# EAGLE design colorimeter (EAGLE 9.3.1)
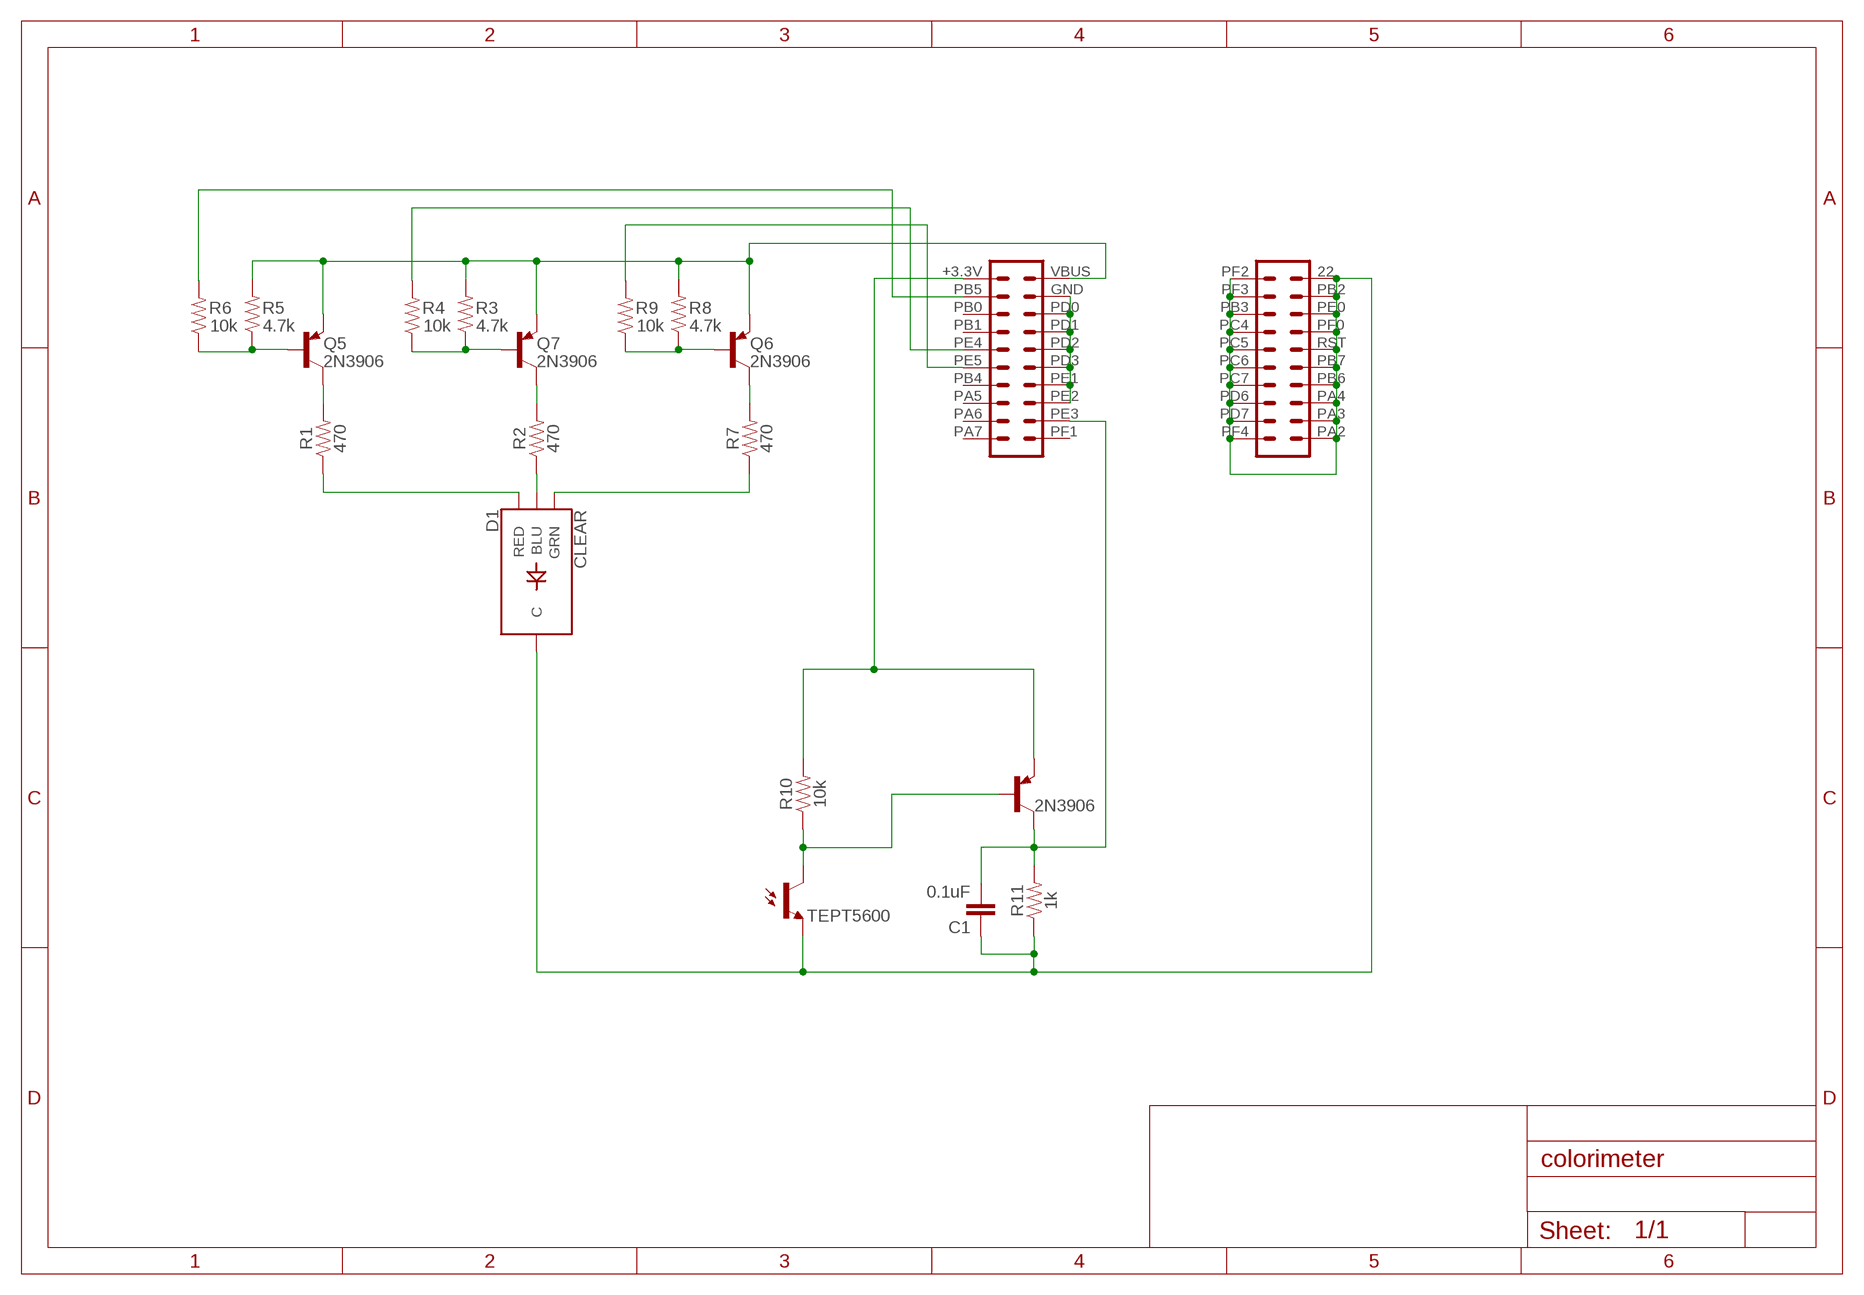
[diagram p0: schematic, sheet 1]

## Parts
C1  0.1uF  0.1UF-KIT-EZ-50V-20%  [CAP-PTH-SMALL-KIT]
D1  CLEAR  LED-RGB-CCCLEAR  [LED-RGB-THRU]
Q1  TEPT5600  PHOTOTRANSISTORPT17-21C-L41-TR8  [PT17-21C-L41-TR8]
Q5  2N3906  2N2907  [TO92-EBC-OVAL]
Q6  2N3906  2N2907  [TO92-EBC-OVAL]
Q7  2N3906  2N2907  [TO92-EBC-OVAL]
R1  470  1KOHM-HORIZ-1/4W-5%  [AXIAL-0.3]
R2  470  1KOHM-HORIZ-1/4W-5%  [AXIAL-0.3]
R3  4.7k  1KOHM-HORIZ-1/4W-5%  [AXIAL-0.3]
R4  10k  1KOHM-HORIZ-1/4W-5%  [AXIAL-0.3]
R5  4.7k  1KOHM-HORIZ-1/4W-5%  [AXIAL-0.3]
R6  10k  1KOHM-HORIZ-1/4W-5%  [AXIAL-0.3]
R7  470  1KOHM-HORIZ-1/4W-5%  [AXIAL-0.3]
R8  4.7k  1KOHM-HORIZ-1/4W-5%  [AXIAL-0.3]
R9  10k  1KOHM-HORIZ-1/4W-5%  [AXIAL-0.3]
R10  10k  10KOHM-HORIZ-1/4W-1%  [AXIAL-0.3]
R11  1k  10KOHM-HORIZ-1/4W-1%  [AXIAL-0.3]
T2  2N3906  2N3906-PNP-TO92-EBC  [TO92-EBC]
U$1  LAUNCHPAD_PINS  [LAUNCHPAD_PINS]

## Nets
N$1: Q5.B R5.P$1 R6.P$1
N$2: Q5.C R1.P$2
N$3: R9.P$2 U$1.PE5
N$4: R4.P$2 U$1.PE4
N$5: Q7.B R3.P$1 R4.P$1
N$6: Q7.C R2.P$2
N$7: D1.1(RED) R1.P$1
N$8: R6.P$2 U$1.PB5
N$9: Q6.B R8.P$1 R9.P$1
N$10: Q6.C R7.P$2
N$11: D1.4(BLU) R2.P$1
N$12: Q1.C R10.P$1 T2.B
N$13: D1.3(GRN) R7.P$1
N$14: C1.2 R11.P$2 T2.C U$1.PE3
N$15: R10.P$2 T2.E U$1.+3.3V
N$16: Q5.E Q6.E Q7.E R3.P$2 R5.P$2 R8.P$2 U$1.VBUS
N$18: C1.1 D1.2(C) Q1.E R11.P$1 U$1.22 U$1.PA2 U$1.PA3 U$1.PA4 U$1.PB2 U$1.PB3 U$1.PB6 U$1.PB7 U$1.PC4 U$1.PC5 U$1.PC6 U$1.PC7 U$1.PD6 U$1.PD7 U$1.PE0 U$1.PF0 U$1.PF2 U$1.PF3 U$1.PF4 U$1.RST
N$19: U$1.GND U$1.PD0 U$1.PD1 U$1.PD2 U$1.PD3 U$1.PE1 U$1.PE2
Unconnected: U$1.PA5 U$1.PA6 U$1.PA7 U$1.PB0 U$1.PB1 U$1.PB4 U$1.PF1

## Library data of the parts
C1 = SparkFun-Capacitors:0.1UF: 0.1µF ceramic capacitors A capacitor is a passive two-terminal electrical component used to store electrical energy temporarily in an electric field.; PROD_ID: CAP-08370
D1 = SparkFun-LED:LED-RGB-CC: LED-RGB Common Cathode Packages: LED RGB-THRU LED_PIRANHA_5MM SparkFun Products: RGB Diffused Common Cathode- Diffuse <[https://www.sparkfun.com/products/9264]> RGB Diffused Common Cathode - Clear <[https://www.sparkfun.com/products/105]> LED-RGB 5mm Square (Piranha) <[https://www.sparkfun.com/products/11679]>; PROD_ID: DIO-08418
Q1 = SparkFun-DiscreteSemi:PHOTOTRANSISTOR: Phototransistor PT17-21C/L41/TR8 is a phototransistor in miniature SMD package which is molded in a water clear with flat top view lens. The device is Spectrally matched to visible and infrared emitting diode. Datasheet <http://www.everlight.com/file/ProductFile/PT17-21C-L41-TR8.pdf> SparkFun Products: SparkFun Electric Imp imp002 Breakout <https://www.sparkfun.com/products/12958>; PROD_ID: TRANS-12141; VALUE: 20mA/30V
Q5-Q7 = adafruit:2N2907*: PNP Transistor Big Oval pads
R1-R9 = SparkFun-Resistors:1KOHM: 1kΩ resistor A resistor is a passive two-terminal electrical component that implements electrical resistance as a circuit element. Resistors act to reduce current flow, and, at the same time, act to lower voltage levels within circuits. - Wikipedia; PROD_ID: RES-08380; VALUE: 1k
R10 = SparkFun-Resistors:10KOHM: 10kΩ resistor A resistor is a passive two-terminal electrical component that implements electrical resistance as a circuit element. Resistors act to reduce current flow, and, at the same time, act to lower voltage levels within circuits. - Wikipedia; PROD_ID: RES-12183
R11 = SparkFun-Resistors:10KOHM: 10kΩ resistor A resistor is a passive two-terminal electrical component that implements electrical resistance as a circuit element. Resistors act to reduce current flow, and, at the same time, act to lower voltage levels within circuits. - Wikipedia; PROD_ID: RES-12183; VALUE: 10k
T2 = transistor-neu-to92:*-PNP-: PNP Transistror
U$1 = kit:LAUNCHPAD_PINS

## Board
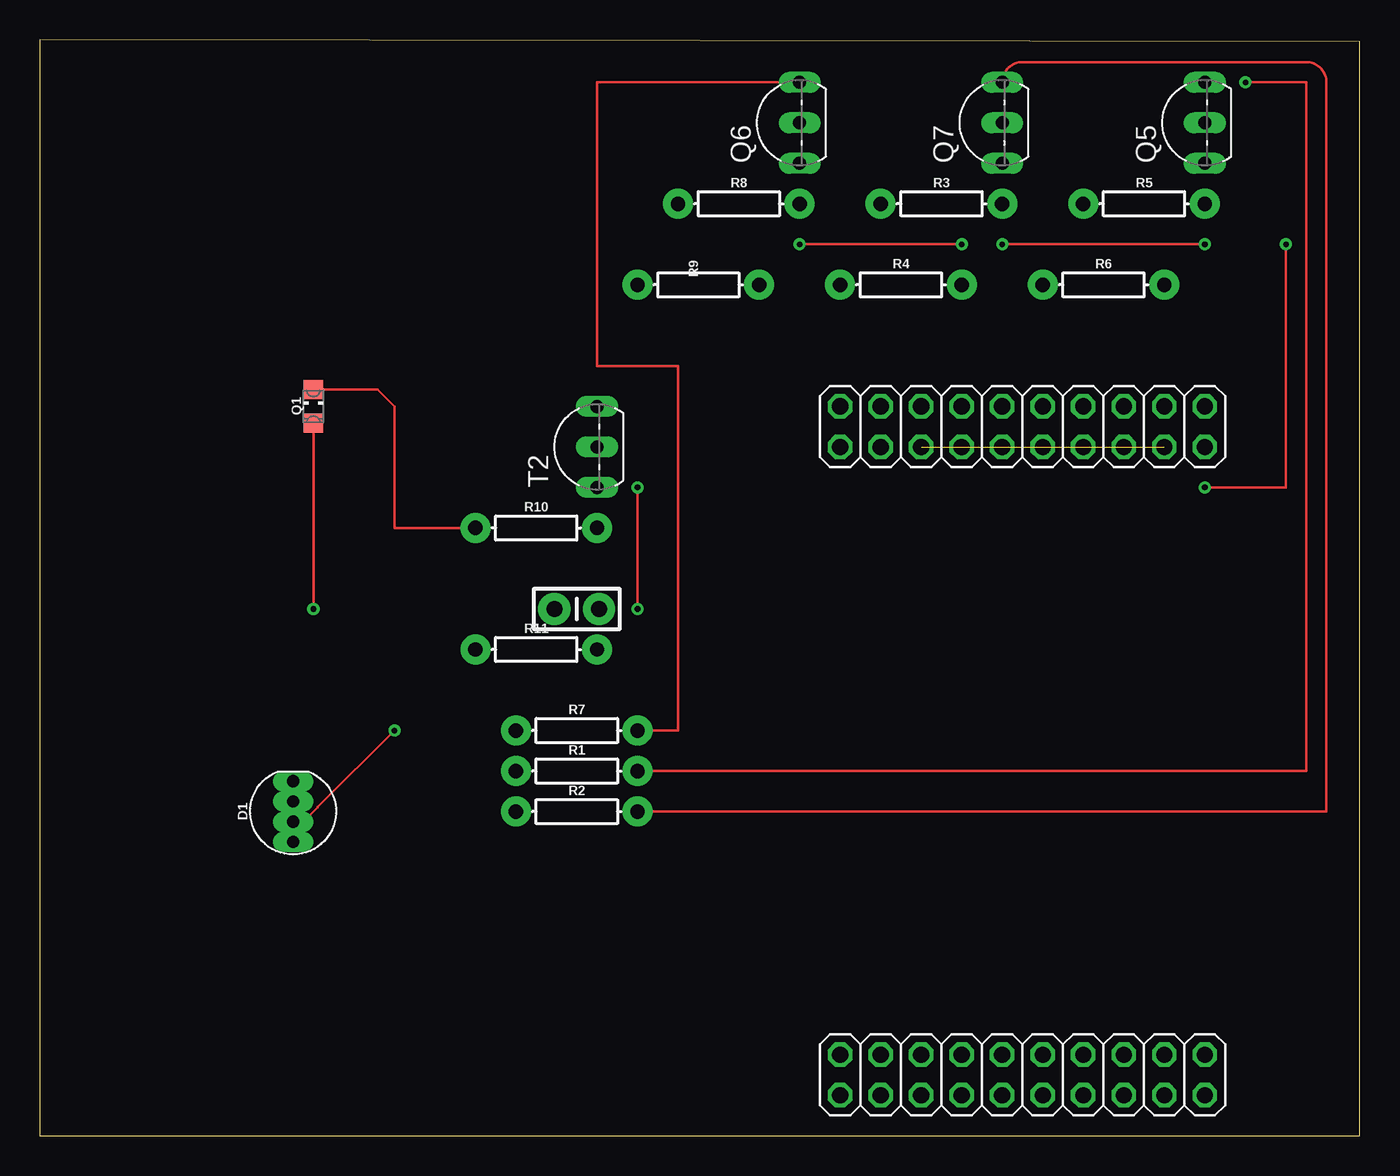
[diagram p1: board, top side]
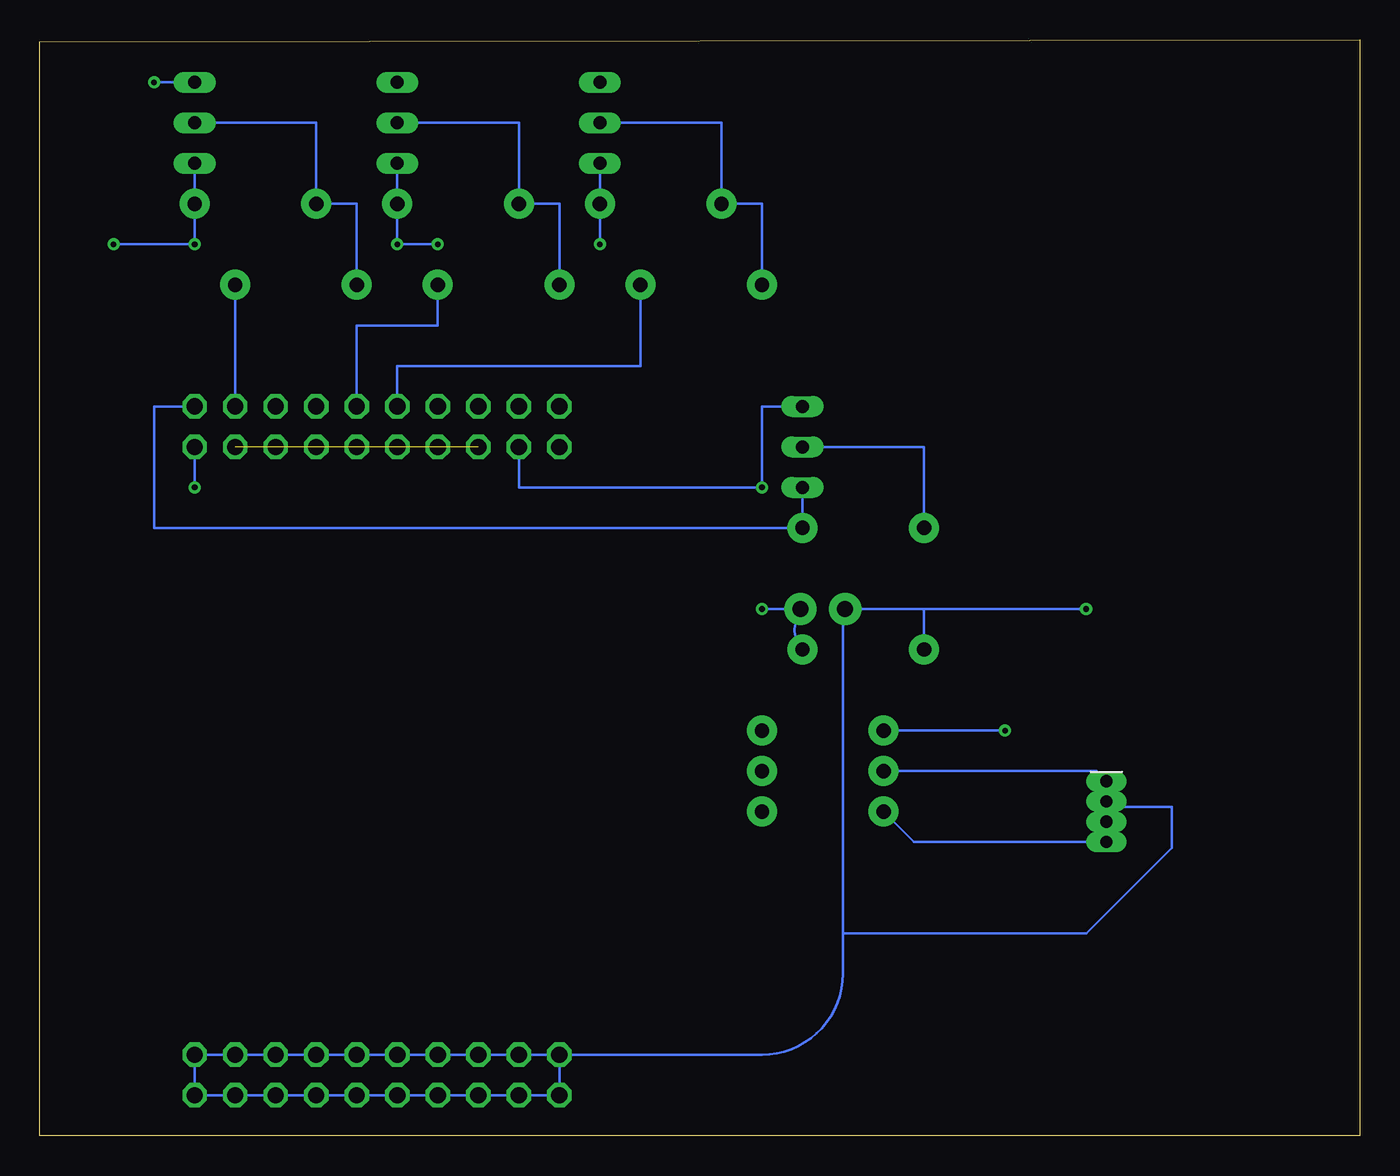
[diagram p2: board, bottom side, seen from below]

Size 82.73 x 68.7 mm. Coordinates in mm from the lower left corner, seen from the top.
Outline: 0,0 82.73,0 82.73,68.57 0,68.7 0,0
Copper layers (1*16): Top 0.035mm / dielectric 1.5mm / Bottom 0.035mm
Design rules "untitled": minimum track width 6mil, minimum drill 0.35mm, track to track 0.205mm, track to pad 0.205mm, pad to pad 0.205mm, via to via 0.205mm, smd to smd 6mil, copper to edge 40mil, drill to drill 6mil, minimum pad ring 10mil, minimum via ring 8mil, stop-mask expansion 4mil, vias tented up to drill 0mil, thermal gap 10mil

### Footprints (pad centres in the part's own frame; a part is rotated, then mirrored left to right if it is on the bottom)
CAP-PTH-SMALL-KIT = drill 1.016 pad 2.032: 1 -1.397,0; 2 1.397,0
LED-RGB-THRU = drill 0.762 pad 0.889 long: 1 1.905,0; 2 0.635,0; 3 -0.635,0; 4 -1.905,0
PT17-21C-L41-TR8 = smd 1.2 x 1.2: C 0,1.05; E 0,-1.05
TO92-EBC-OVAL = drill 0.813 long: B 0,-1.27; C 2.54,-1.27; E -2.54,-1.27
AXIAL-0.3 = drill 0.9 pad 1.88: P$1 -3.81,0; P$2 3.81,0
TO92-EBC = drill 0.813 long: B 0,-1.27; C 2.54,-1.27; E -2.54,-1.27
LAUNCHPAD_PINS = drill 1.016 octagon: 22 31.75,16.51; +3.3V -11.43,16.51; GND -8.89,13.97; PA2 31.75,-6.35; PA3 31.75,-3.81; PA4 31.75,-1.27; PA5 -11.43,-1.27; PA6 -11.43,-3.81; PA7 -11.43,-6.35; PB0 -11.43,11.43; PB1 -11.43,8.89; PB2 31.75,13.97; PB3 29.21,11.43; PB4 -11.43,1.27; PB5 -11.43,13.97; PB6 31.75,1.27; PB7 31.75,3.81; PC4 29.21,8.89; PC5 29.21,6.35; PC6 29.21,3.81; PC7 29.21,1.27; PD0 -8.89,11.43; PD1 -8.89,8.89; PD2 -8.89,6.35; PD3 -8.89,3.81; PD6 29.21,-1.27; PD7 29.21,-3.81; PE0 31.75,11.43; PE1 -8.89,1.27; PE2 -8.89,-1.27; PE3 -8.89,-3.81; PE4 -11.43,6.35; PE5 -11.43,3.81; PF0 31.75,8.89; PF1 -8.89,-6.35; PF2 29.21,16.51; PF3 29.21,13.97; PF4 29.21,-6.35; RST 31.75,6.35; VBUS -8.89,16.51

### Placement (x,y rotation side)
C1  33.66,33.02 0 top
D1  15.88,20.32 90 top
Q1  17.14,45.72 0 top
Q5  71.75,63.5 90 top
Q6  46.36,63.5 90 top
Q7  59.05,63.5 90 top
R1  33.66,22.86 0 top
R2  33.66,20.32 0 top
R3  56.52,58.42 0 top
R4  53.98,53.34 0 top
R5  69.21,58.42 0 top
R6  66.67,53.34 0 top
R7  33.66,25.4 0 top
R8  43.82,58.42 0 top
R9  41.27,53.34 0 top
R10  31.11,38.1 0 top
R11  31.11,30.48 0 top
T2  33.66,43.18 90 top
U$1  56.52,34.29 270 top

### Tracks (layer width: path | path; a pad name or v marks a point on that pad's centre or on a via)
N$1
  Bottom 0.152: Q5.B 65.41,63.5 R5.P$1 62.87,58.42 R6.P$1
N$2  (via drill 0.35)
  Top 0.152: v75.56,66.04 79.38,66.04 79.38,22.86 R1.P$2
  Bottom 0.152: Q5.C v75.56,66.04
N$3
  Bottom 0.152: R9.P$2 45.09,48.26 60.33,48.26 U$1.PE5
N$4
  Bottom 0.152: R4.P$2 57.79,50.8 62.87,50.8 U$1.PE4
N$5
  Bottom 0.152: Q7.B 52.71,63.5 R3.P$1 50.16,58.42 R4.P$1
N$6  (via drill 0.35)
  Top 0.152: Q7.C arc-90 61.59,67.31 79.38,67.31 arc-90 80.64,66.04 80.64,20.32 R2.P$2
  other vias: 60.33,66.04
N$7
  Bottom 0.152: R1.P$1 16.51,22.86 D1.1
N$8
  Bottom 0.152: R6.P$2 U$1.PB5
N$9
  Bottom 0.152: R9.P$1 37.47,58.42 R8.P$1 40.01,63.5 Q6.B
N$10
  Top 0.152: Q6.C 34.93,66.04 34.93,48.26 40.01,48.26 40.01,25.4 R7.P$2
N$11
  Bottom 0.152: D1.4 27.94,18.41 R2.P$1
N$12
  Top 0.152: Q1.C 21.17,46.77 22.22,45.72 22.22,38.1 R10.P$1
  Bottom 0.152: R10.P$1 27.3,43.18 T2.B
N$13  (via drill 0.35)
  Top 0.152: v22.22,25.4 17.43,20.6 17.43,20.57 16.54,19.68 D1.3
  Bottom 0.152: R7.P$1 v22.22,25.4
N$14  (via drill 0.35)
  Top 0.152: v37.47,40.64 v37.47,33.02
  Bottom 0.152: R11.P$2 arc90 34.93,32.89 C1.2 v37.47,33.02 | U$1.PE3 52.71,40.64 v37.47,40.64 37.47,45.72 T2.C
N$15
  Bottom 0.152: U$1.+3.3V 75.56,45.72 75.56,38.1 R10.P$2 T2.E
N$16  (via drill 0.35)
  Top 0.152: v73.02,40.64 78.1,40.64 v78.1,55.88 | v60.33,55.88 v73.02,55.88 | v47.62,55.88 v57.79,55.88
  Bottom 0.152: v73.02,40.64 U$1.VBUS | v78.1,55.88 v73.02,55.88 R5.P$2 Q5.E | v47.62,55.88 R8.P$2 Q6.E | v57.79,55.88 v60.33,55.88 R3.P$2 Q7.E
N$18  (via drill 0.35)
  Top 0.152: Q1.E v17.14,33.02
  Bottom 0.152: U$1.PF4 U$1.PA2 U$1.PA3 U$1.PA4 U$1.PB6 U$1.PB7 U$1.RST U$1.PF0 U$1.PE0 U$1.PB2 U$1.22 U$1.PF2 U$1.PF3 U$1.PB3 U$1.PC4 U$1.PC5 U$1.PC6 U$1.PC7 U$1.PD6 U$1.PD7 U$1.PF4 | 27.3,33.02 R11.P$1 | 27.3,33.02 C1.1 32.39,33.02 32.39,12.7 | 27.3,33.02 v17.14,33.02 | U$1.PF4 37.47,5.08 arc-90 32.39,10.16 32.39,12.7 | D1.2 15.52,20.6 11.78,20.6 11.78,18.04 17.12,12.7 32.39,12.7
N$19  (6 unrouted)

### Text on the board
Measures: A | B | C | D | E | 01 | 02 | 03 | 04 | 05 | 06 | 07 | 08 | 09 | 10 | 11 | 12 | 13 | 14 | 15 | 16 | 17 | 18 | 19 | 20 | 21 | 22 | 23 | 24 | 25 | 26
Reference: A | B | C | D | E | F | G | H | I | J | K | L | M | N | O | P | Q | R | S | T | U | V | W | X | Y | Z